# Altium project ESP32 with USB-C.PrjPcb (part 1 of 3)
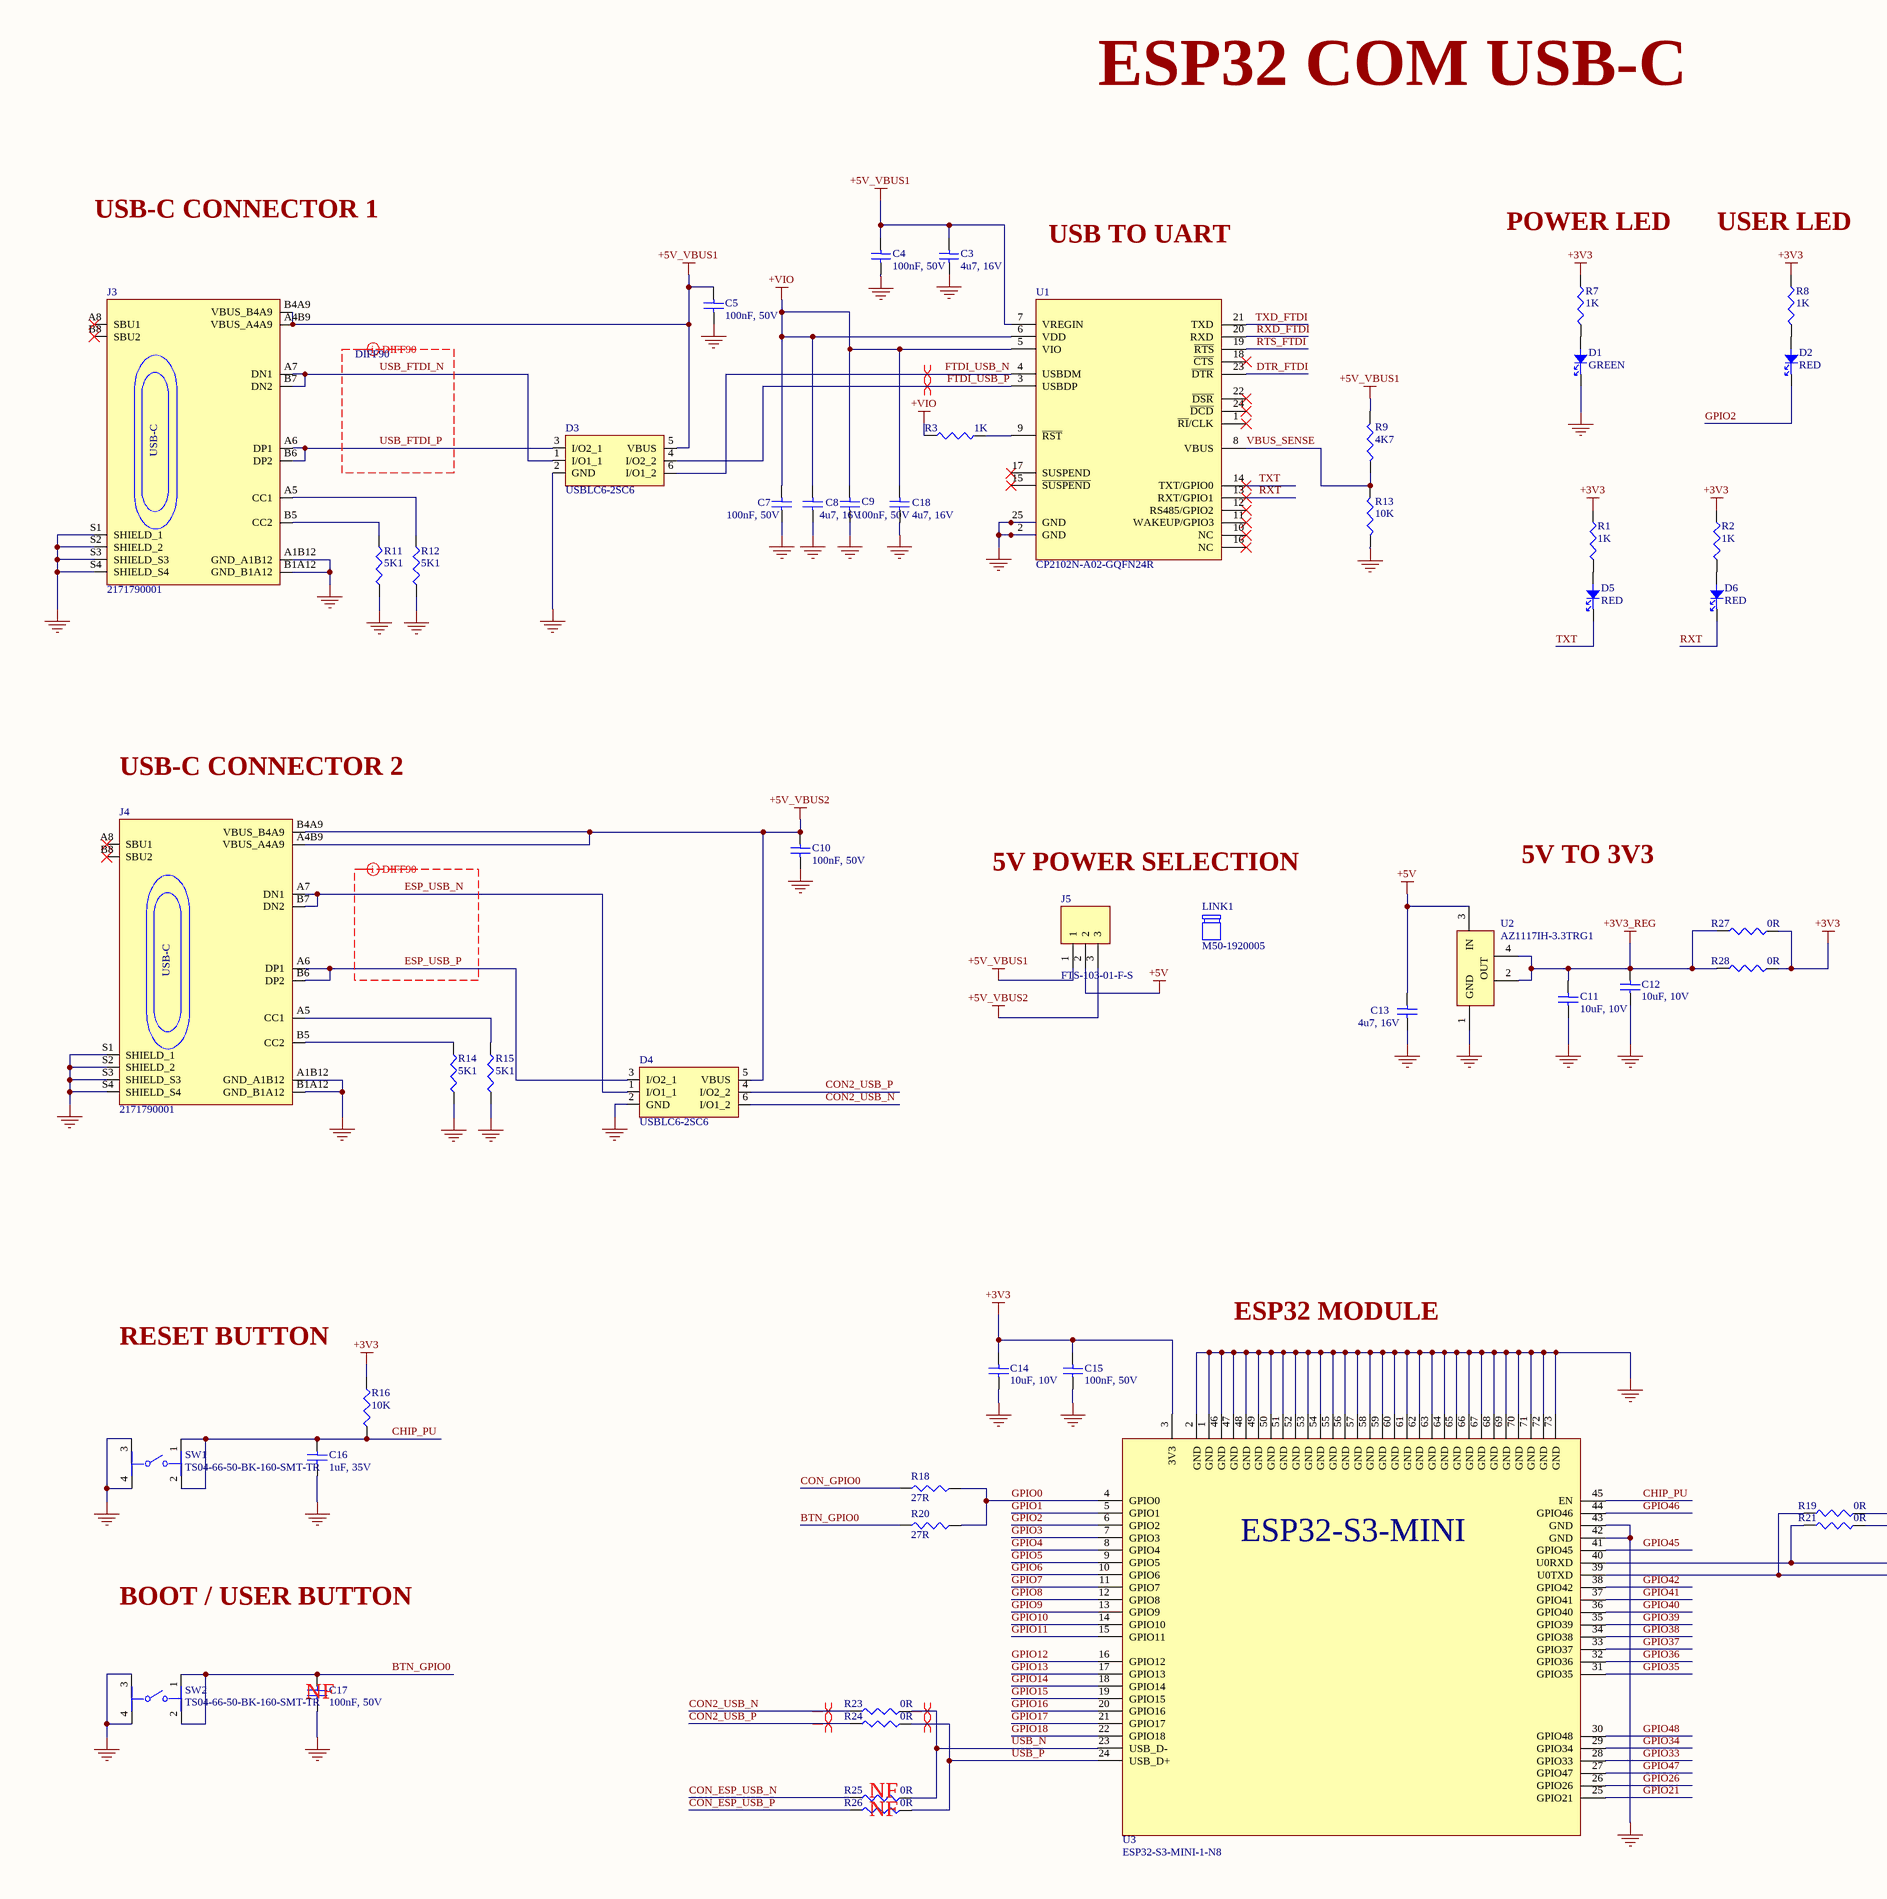
[diagram p0: ESP32 with USBC.SchDoc, left]
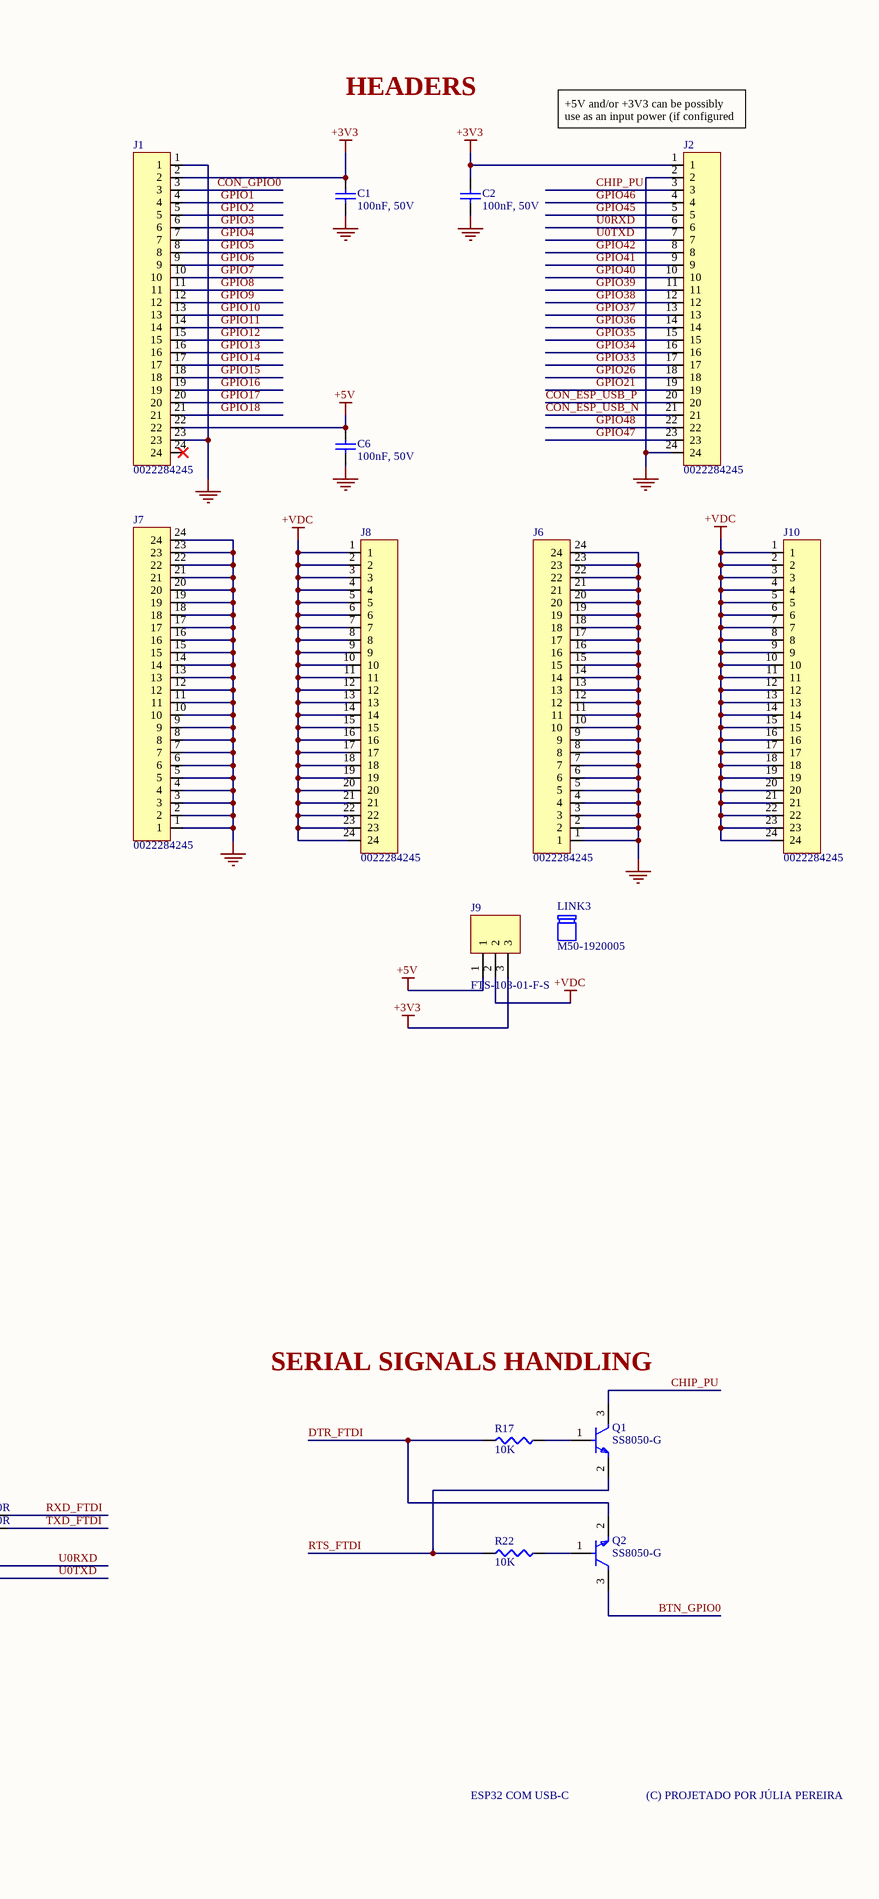
[diagram p1: ESP32 with USBC.SchDoc, right]
1 sheet, 67 parts. Net scope: global (net labels, ports and power ports of the same name join across sheets).
Board file: ESP32 with USBC PCB V1I1.PcbDoc

## Sheet ESP32 with USBC.SchDoc
size A2; SheetNumber: 1; SheetTotal: 1

### Parts
C1  100nF, 50V  [CAPC1005X65N]
C2  100nF, 50V  [CAPC1005X65N]
C3  4u7, 16V  [CAPC1005X65N]
C4  100nF, 50V  [CAPC1005X65N]
C5  100nF, 50V  [CAPC1005X65N]
C6  100nF, 50V  [CAPC1005X65N]
C7  100nF, 50V  [CAPC1005X65N]
C8  4u7, 16V  [CAPC1005X65N]
C9  100nF, 50V  [CAPC1005X65N]
C10  100nF, 50V  [CAPC1005X65N]
C11  10uF, 10V  [CAPC1005X65N]
C12  10uF, 10V  [CAPC1005X65N]
C13  4u7, 16V  [CAPC1005X65N]
C14  10uF, 10V  [CAPC1005X65N]
C15  100nF, 50V  [CAPC1005X65N]
C16  1uF, 35V  [CAPC1005X65N]
C17  100nF, 50V  [CAPC1005X65N]
C18  4u7, 16V  [CAPC1005X65N]
D1  GREEN  [LED0402G]
D2  RED  [LED0402R]
D3  USBLC6-2SC6  [SOT23-6L_STM-L]
D4  USBLC6-2SC6  [SOT23-6L_STM-L]
D5  RED  [LED0402R]
D6  RED  [LED0402R]
J1  0022284245  [HDR_1X24_2.54MM]
J2  0022284245  [HDR_1X24_2.54MM]
J3  2171790001  [FP-2171790001-MFG]
J4  2171790001  [FP-2171790001-MFG]
J5  FTS-103-01-F-S  [HDR_1X3_2X54MM]
J6  0022284245  [HDR_1X24_2.54MM]
J7  0022284245  [HDR_1X24_2.54MM]
J8  0022284245  [HDR_1X24_2.54MM]
J9  FTS-103-01-F-S  [HDR_1X3_2X54MM]
J10  0022284245  [HDR_1X24_2.54MM]
LINK1  M50-1920005  (mechanical)
LINK3  M50-1920005  (mechanical)
Q1  SS8050-G  [FP-SS8050-G-IPC_B]
Q2  SS8050-G  [FP-SS8050-G-IPC_B]
R1  1K  [RESC1005X37N]
R2  1K  [RESC1005X37N]
R3  1K  [RESC1005X37N]
R7  1K  [RESC1005X37N]
R8  1K  [RESC1005X37N]
R9  4K7  [RESC1005X37N]
R11  5K1  [RESC1005X37N]
R12  5K1  [RESC1005X37N]
R13  10K  [RESC1005X37N]
R14  5K1  [RESC1005X37N]
R15  5K1  [RESC1005X37N]
R16  10K  [RESC1005X37N]
R17  10K  [RESC1005X37N]
R18  27R  [RESC1005X37N]
R19  0R  [RESC1005X37N]
R20  27R  [RESC1005X37N]
R21  0R  [RESC1005X37N]
R22  10K  [RESC1005X37N]
R23  0R  [RESC1005X37N]
R24  0R  [RESC1005X37N]
R25  0R  [RESC1005X37N]
R26  0R  [RESC1005X37N]
R27  0R  [RESC2012X60N]
R28  0R  [RESC2012X60N]
SW1  TS04-66-50-BK-160-SMT-TR  [TS04-66-50-BK-160-SMT-TR]
SW2  TS04-66-50-BK-160-SMT-TR  [TS04-66-50-BK-160-SMT-TR]
U1  CP2102N-A02-GQFN24R  [QFN50P400X400X80-25N]
U2  AZ1117IH-3.3TRG1  [DCY0004A_N]
U3  ESP32-S3-MINI-1-N8  [XCVR_ESP32-S3-MINI-1-N8]

### Nets
+3V3: C1.2 C2.2 C14.2 C15.2 J1.2 J2.1 J9.3 R1.2 R2.2 R7.2 R8.2 R16.2 R27.2 R28.2 U3.3(3V3)
+3V3_REG: C11.2 C12.2 R27.1 R28.1 U2.2(OUT) U2.4(OUT)
+5V: C6.2 C13.2 J1.22 J5.2 J9.1 U2.3(IN)
+5V_VBUS1: C3.2 C4.2 C5.2 D3.5(VBUS) J3.A4B9(VBUS_A4A9) J3.B4A9(VBUS_B4A9) J5.1 R9.2 U1.7(VREGIN)
+5V_VBUS2: C10.2 D4.5(VBUS) J4.A4B9(VBUS_A4A9) J4.B4A9(VBUS_B4A9) J5.3
+VDC: J8.1 J8.2 J8.3 J8.4 J8.5 J8.6 J8.7 J8.8 J8.9 J8.10 J8.11 J8.12 J8.13 J8.14 J8.15 J8.16 J8.17 J8.18 J8.19 J8.20 J8.21 J8.22 J8.23 J8.24 J9.2 J10.1 J10.2 J10.3 J10.4 J10.5 J10.6 J10.7 J10.8 J10.9 J10.10 J10.11 J10.12 J10.13 J10.14 J10.15 J10.16 J10.17 J10.18 J10.19 J10.20 J10.21 J10.22 J10.23 J10.24
+VIO: C7.2 C8.2 C9.2 C18.2 R3.2 U1.5(VIO) U1.6(VDD)
GND: C1.1 C2.1 C3.1 C4.1 C5.1 C6.1 C7.1 C8.1 C9.1 C10.1 C11.1 C12.1 C13.1 C14.1 C15.1 C16.1 C17.1 C18.1 D1.1 D3.2(GND) D4.2(GND) J1.1 J1.23 J2.2 J2.24 J3.A1B12(GND_A1B12) J3.B1A12(GND_B1A12) J3.S1(SHIELD_1) J3.S2(SHIELD_2) J3.S3(SHIELD_S3) J3.S4(SHIELD_S4) J4.A1B12(GND_A1B12) J4.B1A12(GND_B1A12) J4.S1(SHIELD_1) J4.S2(SHIELD_2) J4.S3(SHIELD_S3) J4.S4(SHIELD_S4) J6.1 J6.2 J6.3 J6.4 J6.5 J6.6 J6.7 J6.8 J6.9 J6.10 J6.11 J6.12 J6.13 J6.14 J6.15 J6.16 J6.17 J6.18 J6.19 J6.20 J6.21 J6.22 J6.23 J6.24 J7.1 J7.2 J7.3 J7.4 J7.5 J7.6 J7.7 J7.8 J7.9 J7.10 J7.11 J7.12 J7.13 J7.14 J7.15 J7.16 J7.17 J7.18 J7.19 J7.20 J7.21 J7.22 J7.23 J7.24 R11.1 R12.1 R13.1 R14.1 R15.1 SW1.3 SW1.4 SW2.3 SW2.4 U1.2(GND) U1.25(GND) U2.1(GND) U3.1(GND) U3.2(GND) U3.42(GND) U3.43(GND) U3.46(GND) U3.47(GND) U3.48(GND) U3.49(GND) U3.50(GND) U3.51(GND) U3.52(GND) U3.53(GND) U3.54(GND) U3.55(GND) U3.56(GND) U3.57(GND) U3.58(GND) U3.59(GND) U3.60(GND) U3.61(GND) U3.62(GND) U3.63(GND) U3.64(GND) U3.65(GND) U3.66(GND) U3.67(GND) U3.68(GND) U3.69(GND) U3.70(GND) U3.71(GND) U3.72(GND) U3.73(GND)
BTN_GPIO0: C17.2 Q2.3(C) R20.1 SW2.1 SW2.2
CHIP_PU: C16.2 J2.3 Q1.3(C) R16.1 SW1.1 SW1.2 U3.45(EN)
CON2_USB_N: D4.6(I/O1_2) R23.1
CON2_USB_P: D4.4(I/O2_2) R24.1
CON_ESP_USB_N: J2.21 R25.1
CON_ESP_USB_P: J2.20 R26.1
CON_GPIO0: J1.3 R18.1
DTR_FTDI: Q2.2(E) R17.2 U1.23(~{DTR})
ESP_USB_N: D4.1(I/O1_1) J4.A7(DN1) J4.B7(DN2)
ESP_USB_P: D4.3(I/O2_1) J4.A6(DP1) J4.B6(DP2)
FTDI_USB_N: D3.6(I/O1_2) U1.4(USBDM)
FTDI_USB_P: D3.4(I/O2_2) U1.3(USBDP)
GPIO0: R18.2 R20.2 U3.4(GPIO0)
GPIO1: J1.4 U3.5(GPIO1)
GPIO2: D2.1 J1.5 U3.6(GPIO2)
GPIO3: J1.6 U3.7(GPIO3)
GPIO4: J1.7 U3.8(GPIO4)
GPIO5: J1.8 U3.9(GPIO5)
GPIO6: J1.9 U3.10(GPIO6)
GPIO7: J1.10 U3.11(GPIO7)
GPIO8: J1.11 U3.12(GPIO8)
GPIO9: J1.12 U3.13(GPIO9)
GPIO10: J1.13 U3.14(GPIO10)
GPIO11: J1.14 U3.15(GPIO11)
GPIO12: J1.15 U3.16(GPIO12)
GPIO13: J1.16 U3.17(GPIO13)
GPIO14: J1.17 U3.18(GPIO14)
GPIO15: J1.18 U3.19(GPIO15)
GPIO16: J1.19 U3.20(GPIO16)
GPIO17: J1.20 U3.21(GPIO17)
GPIO18: J1.21 U3.22(GPIO18)
GPIO21: J2.19 U3.25(GPIO21)
GPIO26: J2.18 U3.26(GPIO26)
GPIO33: J2.17 U3.28(GPIO33)
GPIO34: J2.16 U3.29(GPIO34)
GPIO35: J2.15 U3.31(GPIO35)
GPIO36: J2.14 U3.32(GPIO36)
GPIO37: J2.13 U3.33(GPIO37)
GPIO38: J2.12 U3.34(GPIO38)
GPIO39: J2.11 U3.35(GPIO39)
GPIO40: J2.10 U3.36(GPIO40)
GPIO41: J2.9 U3.37(GPIO41)
GPIO42: J2.8 U3.38(GPIO42)
GPIO45: J2.5 U3.41(GPIO45)
GPIO46: J2.4 U3.44(GPIO46)
GPIO47: J2.23 U3.27(GPIO47)
GPIO48: J2.22 U3.30(GPIO48)
RTS_FTDI: Q1.2(E) R22.2 U1.19(~{RTS})
RXD_FTDI: R19.2 U1.20(RXD)
RXT: D6.1 U1.13(RXT/GPIO1)
TXD_FTDI: R21.2 U1.21(TXD)
TXT: D5.1 U1.14(TXT/GPIO0)
U0RXD: J2.6 R21.1 U3.40(U0RXD)
U0TXD: J2.7 R19.1 U3.39(U0TXD)
USB_FTDI_N: D3.1(I/O1_1) J3.A7(DN1) J3.B7(DN2)
USB_FTDI_P: D3.3(I/O2_1) J3.A6(DP1) J3.B6(DP2)
USB_N: R23.2 R25.2 U3.23(USB_D-)
USB_P: R24.2 R26.2 U3.24(USB_D+)
VBUS_SENSE: R9.1 R13.2 U1.8(VBUS)
NetD1_2: D1.2 R7.1
NetD2_2: D2.2 R8.1
NetD5_2: D5.2 R1.1
NetD6_2: D6.2 R2.1
NetJ3_A5: J3.A5(CC1) R12.2
NetJ3_B5: J3.B5(CC2) R11.2
NetJ4_A5: J4.A5(CC1) R15.2
NetJ4_B5: J4.B5(CC2) R14.2
NetQ1_1: Q1.1(B) R17.1
NetQ2_1: Q2.1(B) R22.1
NetR3_1: R3.1 U1.9(~{RST})

Not connected (* = marked no-connect by the designer): J1 24*; J3 A8(SBU1)* B8(SBU2)*; J4 A8(SBU1)* B8(SBU2)*; U1 1(~{RI}/CLK)* 10(NC)* 11(WAKEUP/GPIO3)* 12(RS485/GPIO2)* 15(~{SUSPEND})* 16(NC)* 17(SUSPEND)* 18(~{CTS})* 22(~{DSR})* 24(~{DCD})*

### Layout directives
differential pair; differential pair class DIFF90: CON2_USB_N, CON2_USB_P, FTDI_USB_N, FTDI_USB_P, USB_FTDI_N, USB_FTDI_P, USB_N, USB_P
differential pair: ESP_USB_N, ESP_USB_P

### Notes on the sheet
- ESP32 COM USB-C
- HEADERS
- (near J2) +5V and/or +3V3 can be possibly use as an input power (if configured correctly)
- USB-C CONNECTOR 1
- USB TO UART
- POWER LED
- USER LED
- USB-C CONNECTOR 2
- (near LINK1) 5V POWER SELECTION
- 5V TO 3V3
- RESET BUTTON
- ESP32 MODULE
- SERIAL SIGNALS HANDLING
- BOOT / USER BUTTON
- (near C17) NF
- (near R25) NF
- (C) PROJETADO POR JÚLIA PEREIRA
- NF
- (in symbol 217179-0001) USB-C
- (in symbol ESP32-S3-MINI-1-N8) ESP32-S3-MINI